# Altium schematic sheet Power.SchDoc
size A4; SheetNumber: 2; SheetTotal: 11
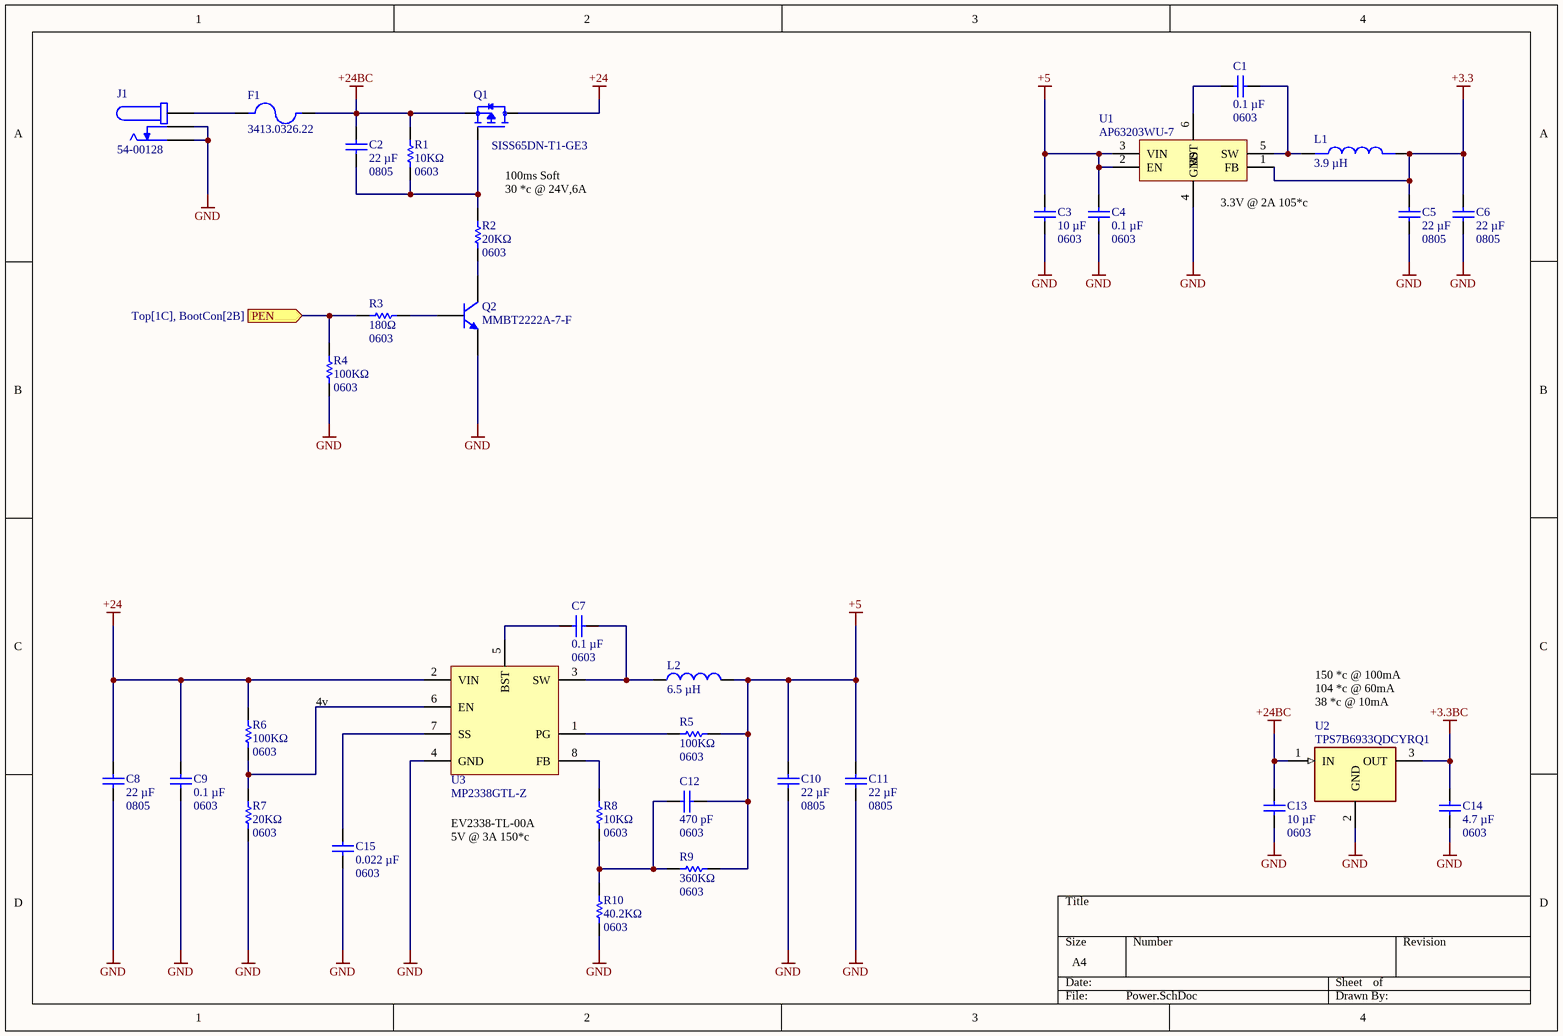
[diagram p0: Power.SchDoc]

## Parts
C1  value 0.1 µF  [0603]  (hidden comment: GRM188R72A104MA35J)
C2  value 22 µF  [0805]  (hidden comment: C2012X5R1V226M125AC)
C3  value 10 µF  [0603]  (hidden comment: GRM188R6YA106MA73D)
C4  value 0.1 µF  [0603]  (hidden comment: GRM188R72A104MA35J)
C5  value 22 µF  [0805]  (hidden comment: C2012X5R1V226M125AC)
C6  value 22 µF  [0805]  (hidden comment: C2012X5R1V226M125AC)
C7  value 0.1 µF  [0603]  (hidden comment: GRM188R72A104MA35J)
C8  value 22 µF  [0805]  (hidden comment: C2012X5R1V226M125AC)
C9  value 0.1 µF  [0603]  (hidden comment: GRM188R72A104MA35J)
C10  value 22 µF  [0805]  (hidden comment: C2012X5R1V226M125AC)
C11  value 22 µF  [0805]  (hidden comment: C2012X5R1V226M125AC)
C12  value 470 pF  [0603]  (hidden comment: GRM1885C2A471JA01D)
C13  value 10 µF  [0603]  (hidden comment: GRM188R6YA106MA73D)
C14  value 4.7 µF  [0603]  (hidden comment: GRM188R6YA475KE15D)
C15  value 0.022 µF  [0603]  (hidden comment: GRM188R72A223KAC4D)
F1  3413.0326.22  [1206]
J1  54-00128  [5.5X2.5MM]
L1  value 3.9 µH  [6.30mm x 6.30mm]  (hidden comment: 1255AY-3R9N=P3)
L2  value 6.5 µH  [7.00mm x 6.90mm]  (hidden comment: 744314650)
Q1  SISS65DN-T1-GE3  [PowerPAK® 1212-8S]
Q2  MMBT2222A-7-F  [SOT-23-3]
R1  value 10KΩ  [0603]  (hidden comment: RMCF0603FG10K0)
R2  value 20KΩ  [0603]  (hidden comment: RMCF0603FG20K0)
R3  value 180Ω  [0603]  (hidden comment: RMCF0603FT180R)
R4  value 100KΩ  [0603]  (hidden comment: RMCF0603FG100K)
R5  value 100KΩ  [0603]  (hidden comment: RMCF0603FG100K)
R6  value 100KΩ  [0603]  (hidden comment: RMCF0603FG100K)
R7  value 20KΩ  [0603]  (hidden comment: RMCF0603FG20K0)
R8  value 10KΩ  [0603]  (hidden comment: RMCF0603FG10K0)
R9  value 360KΩ  [0603]  (hidden comment: RMCF0603FT360K)
R10  value 40.2KΩ  [0603]  (hidden comment: RMCF0603FT40K2)
U1  AP63203WU-7  [TSOT-23-6]
U2  TPS7B6933QDCYRQ1  [SOT-223-4]
U3  MP2338GTL-Z  [SOT-583]

## Ports
PEN (in, see Top[1C], BootCon[2B])

## Nets
+3.3: C5.1 C6.1 L1.2 U1.1(FB)
+3.3BC: C14.1 U2.3(OUT)
+5: C3.2 C4.1 C10.1 C11.1 C12.1 L2.2 R5.1 R9.1 U1.2(EN) U1.3(VIN)
+24: C8.1 C9.1 Q1.5(D) R6.1 U3.2(VIN)
+24BC: C2.1 C13.2 F1.2 Q1.1(S) R1.2 U2.1(IN)
GND: C3.1 C4.2 C5.2 C6.2 C8.2 C9.2 C10.2 C11.2 C13.1 C14.2 C15.1 J1.B J1.C Q2.2(E) R4.2 R7.2 R10.1 U1.4(GND) U2.2(GND) U3.4(GND)
PEN: R3.2 R4.1 ; port PEN
NetC1_1: C1.1 L1.1 U1.5(SW)
NetC1_2: C1.2 U1.6(BST)
NetC2_2: C2.2 Q1.4(G) R1.1 R2.1
NetC7_1: C7.1 L2.1 U3.3(SW)
NetC7_2: C7.2 U3.5(BST)
NetC12_2: C12.2 R8.1 R9.2 R10.2
NetC15_2: C15.2 U3.7(SS)
NetF1_1: F1.1 J1.A
NetQ2_1: Q2.1(B) R3.1
NetQ2_3: Q2.3(C) R2.2
NetR5_2: R5.2 U3.1(PG)
NetR6_2: R6.2 R7.1 U3.6(EN)
NetR8_2: R8.2 U3.8(FB)

## Notes on the sheet
- 100ms Soft
  30 *c @ 24V,6A
- (near U1) 3.3V @ 2A 105*c
- 4v
- 150 *c @ 100mA
  104 *c @ 60mA
  38 *c @ 10mA
- EV2338-TL-00A
  5V @ 3A 150*c

## Library data of the parts
C1 C4 C7 C9 = GRM188R72A104MA35J: 0.1 µF ±20% 100V Ceramic Capacitor X7R 0603 (1608 Metric); Case: 0603; Tolerance: ±20%; Temperature Coefficient: X7R; Voltage: 100V
C2 C5 C6 C8 C10 C11 = C2012X5R1V226M125AC: CAP CER 22UF 35V X5R 0805; Tolerance: ±20%; Voltage: 35V; Temperature Coefficient: X5R; Case: 0805
C3 C13 = GRM188R6YA106MA73D: 10 µF ±20% 35V Ceramic Capacitor X5R 0603 (1608 Metric); Case: 0603; Tolerance: ±20%; Temperature Coefficient: X5R; Voltage: 35V
C12 = GRM1885C2A471JA01D: 470 pF ±5% 100V Ceramic Capacitor C0G, NP0 0603 (1608 Metric); Case: 0603; Tolerance: ±5%; Temperature Coefficient: NP0; Voltage: 100V
C14 = GRM188R6YA475KE15D: 4.7 µF ±10% 35V Ceramic Capacitor X5R 0603 (1608 Metric); Case: 0603; Tolerance: ±10%; Temperature Coefficient: X5R; Voltage: 35V
C15 = GRM188R72A223KAC4D: 0.022 µF ±10% 100V Ceramic Capacitor X7R 0603 (1608 Metric); Temperature Coefficient: X5R; Case: 0603; Tolerance: ±10%; Voltage: 100V
F1 = 3413.0326.22: 7 A 32 V AC 63 V DC Fuse Board Mount (Cartridge Style Excluded) Surface Mount 1206 (3216 Metric); Current Rating: 7A; Voltage Rating: 63V; Case: 1206
J1 = 54-00128: Power Barrel Connector Jack 2.50mm ID (0.098"), 5.50mm OD (0.217") Through Hole, Right Angle; Voltage: 48V; Current Rating: 6.5A
L1 = 1255AY-3R9N=P3: 3.9 µH Shielded Drum Core, Wirewound Inductor 4.2 A 22mOhm Nonstandard; Current: 4.2A; DC Resistance: 22mOhm
L2 = 744314650: 6.5 µH Shielded Wirewound Inductor 6 A 21.5mOhm Nonstandard; Current Rating: 6A; Frequency: 50MHz; DC Resistance: 21.5mOhm
Q1 = SISS65DN-T1-GE3: P-Channel 30 V 25.9A (Ta), 94A (Tc) 5.1W (Ta), 65.8W (Tc) Surface Mount PowerPAK® 1212-8S; pin to pad: 1>1+2+3 5>5+6+7+8
Q2 = MMBT2222A-7-F: Bipolar (BJT) Transistor NPN 40 V 600 mA 300MHz 310 mW Surface Mount SOT-23-3
R1 R8 = RMCF0603FG10K0: 10 kOhms ±1% 0.1W, 1/10W Chip Resistor 0603 (1608 Metric) Automotive AEC-Q200 Thick Film; Case: 0603; Tolerance: 1%; Power: 0.1W
R2 R7 = RMCF0603FG20K0: 20 kOhms ±1% 0.1W, 1/10W Chip Resistor 0603 (1608 Metric) Automotive AEC-Q200 Thick Film; Case: 0603; Tolerance: 1%; Power: 0.1W
R3 = RMCF0603FT180R: 180 Ohms ±1% 0.1W, 1/10W Chip Resistor 0603 (1608 Metric) Automotive AEC-Q200 Thick Film; Case: 0603; Tolerance: 1%; Power: 0.1W
R4-R6 = RMCF0603FG100K: 100 kOhms ±1% 0.1W, 1/10W Chip Resistor 0603 (1608 Metric) Automotive AEC-Q200 Thick Film; Case: 0603; Tolerance: 1%; Power: 0.1W
R9 = RMCF0603FT360K: 360 kOhms ±1% 0.1W, 1/10W Chip Resistor 0603 (1608 Metric) Automotive AEC-Q200 Thick Film; Case: 0603; Tolerance: 1%; Power: 0.1W
R10 = RMCF0603FT40K2: 40.2 kOhms ±1% 0.1W, 1/10W Chip Resistor 0603 (1608 Metric) Automotive AEC-Q200 Thick Film; Case: 0603; Tolerance: 1%; Power: 0.1W
U1 = AP63203WU-7: Buck Switching Regulator IC Positive Fixed 3.3V 1 Output 2A SOT-23-6 Thin, TSOT-23-6
U2 = TPS7B6933QDCYRQ1: Linear Voltage Regulator IC Positive Fixed 1 Output 150mA SOT-223-4; pin to pad: 2>2+4
U3 = MP2338GTL-Z: Buck Switching Regulator IC Positive Adjustable 0.5V 1 Output 3A SOT-583